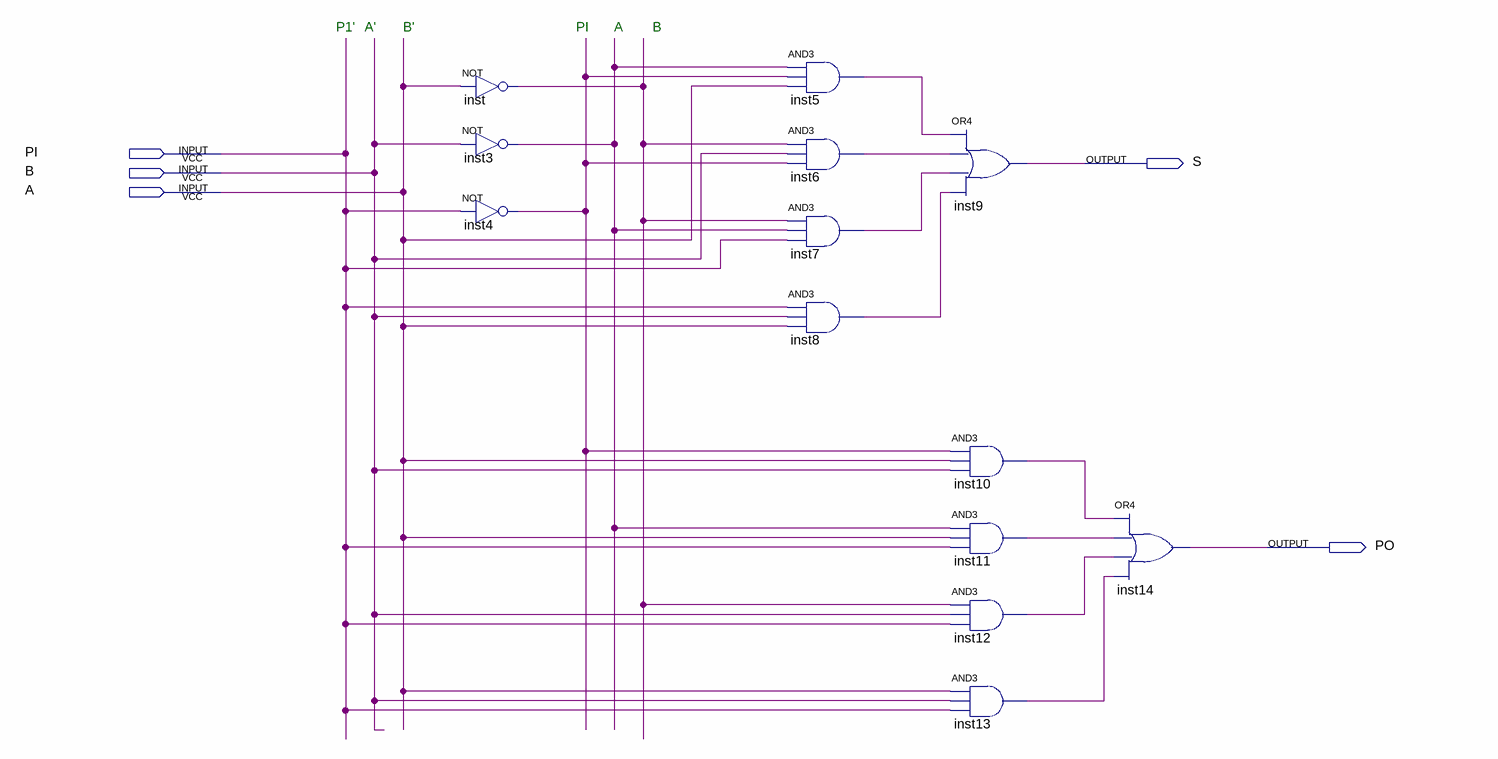
[diagram p0: schematic sheet]
// Quartus schematic cmb5.bdf as structural Verilog: 13 symbols, 5 pins
module cmb5 (
  input  PI,
  input  B,
  input  A,
  output S,
  output PO
);

  wire inst3_out, inst4_out, inst5_out, inst6_out, inst7_out, inst8_out, inst10_out, inst11_out, inst12_out,
       inst13_out, inst_out;

  not inst (inst_out, A);
  not inst3 (inst3_out, B);
  not inst4 (inst4_out, PI);
  and inst5 (inst5_out, inst3_out, inst4_out, A);
  and inst6 (inst6_out, inst_out, B, inst4_out);
  and inst7 (inst7_out, inst_out, inst3_out, PI);
  and inst8 (inst8_out, PI, B, A);
  or inst9 (S, inst5_out, inst6_out, inst7_out, inst8_out);
  and inst10 (inst10_out, inst4_out, A, B);
  and inst11 (inst11_out, inst3_out, A, PI);
  and inst12 (inst12_out, inst_out, B, PI);
  and inst13 (inst13_out, A, B, PI);
  or inst14 (PO, inst10_out, inst11_out, inst12_out, inst13_out);

  // Notes on the sheet:
  //   P1'
  //   A'
  //   B'
  //   PI
  //   A
  //   B
endmodule
